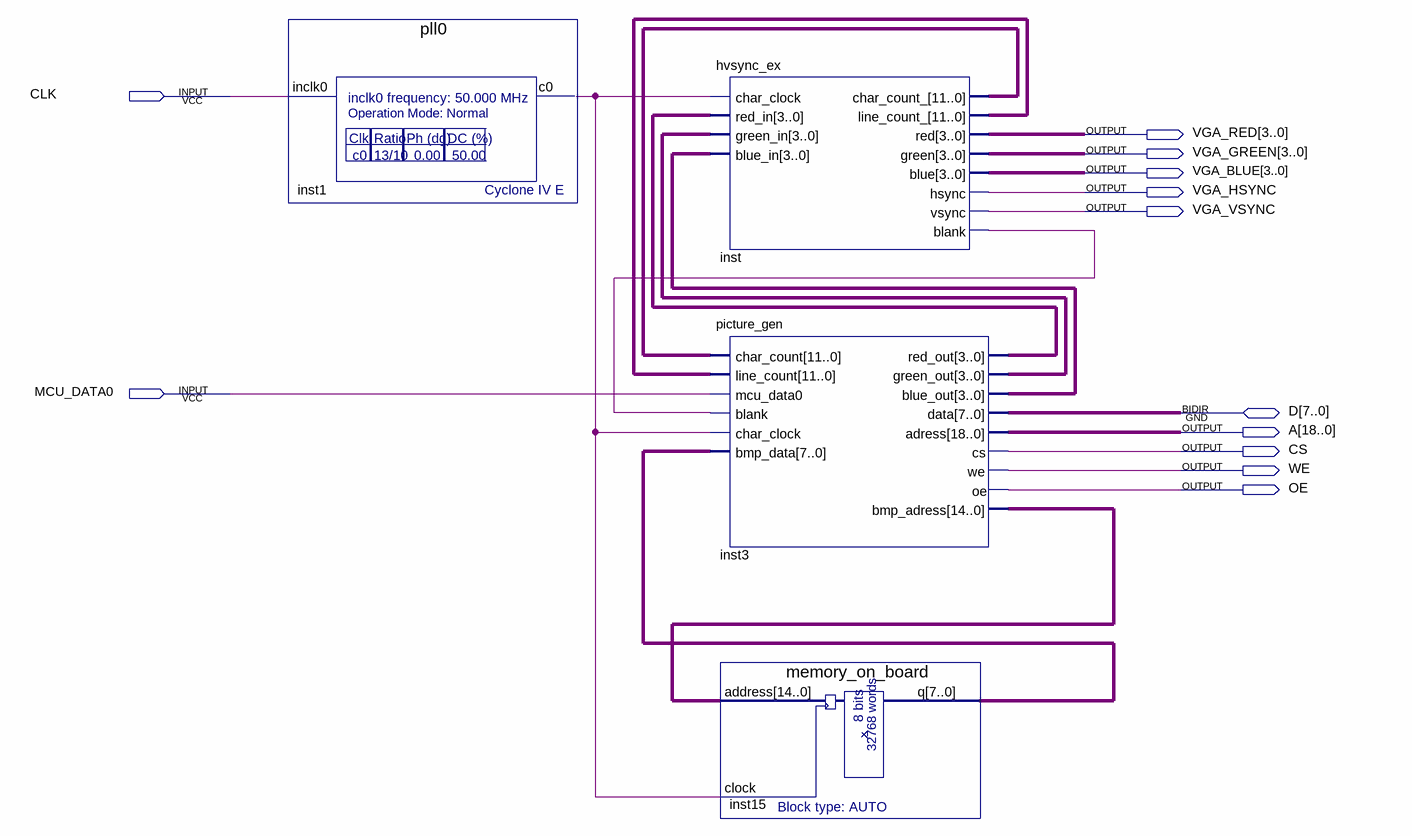
[diagram p0: schematic sheet]
// Quartus schematic test_hardware.bdf as structural Verilog: 4 symbols, 12 pins
module test_hardware (
  input  CLK,
  input  MCU_DATA0,
  inout  [7:0] D,
  output [3:0] VGA_RED,
  output [3:0] VGA_GREEN,
  output [3:0] VGA_BLUE,
  output VGA_HSYNC,
  output VGA_VSYNC,
  output [18:0] A,
  output CS,
  output WE,
  output OE
);

  wire inst1_c0, inst_blank;
  wire [3:0] inst3_blue_out, inst3_green_out, inst3_red_out;
  wire [7:0] inst15_q;
  wire [11:0] inst_char_count_, inst_line_count_;
  wire [14:0] inst3_bmp_adress;

  pll0 inst1 (.inclk0(CLK), .c0(inst1_c0));
  hvsync_ex inst (
    .char_clock(inst1_c0), .red_in(inst3_red_out), .green_in(inst3_green_out), .blue_in(inst3_blue_out),
    .char_count_(inst_char_count_), .line_count_(inst_line_count_), .red(VGA_RED), .green(VGA_GREEN),
    .blue(VGA_BLUE), .hsync(VGA_HSYNC), .vsync(VGA_VSYNC), .blank(inst_blank));
  picture_gen inst3 (
    .char_count(inst_char_count_), .line_count(inst_line_count_), .mcu_data0(MCU_DATA0), .blank(inst_blank),
    .char_clock(inst1_c0), .bmp_data(inst15_q), .red_out(inst3_red_out), .green_out(inst3_green_out),
    .blue_out(inst3_blue_out), .adress(A), .cs(CS), .we(WE), .oe(OE), .bmp_adress(inst3_bmp_adress), .data(D));
  memory_on_board inst15 (.address(inst3_bmp_adress), .clock(inst1_c0), .q(inst15_q));
endmodule
